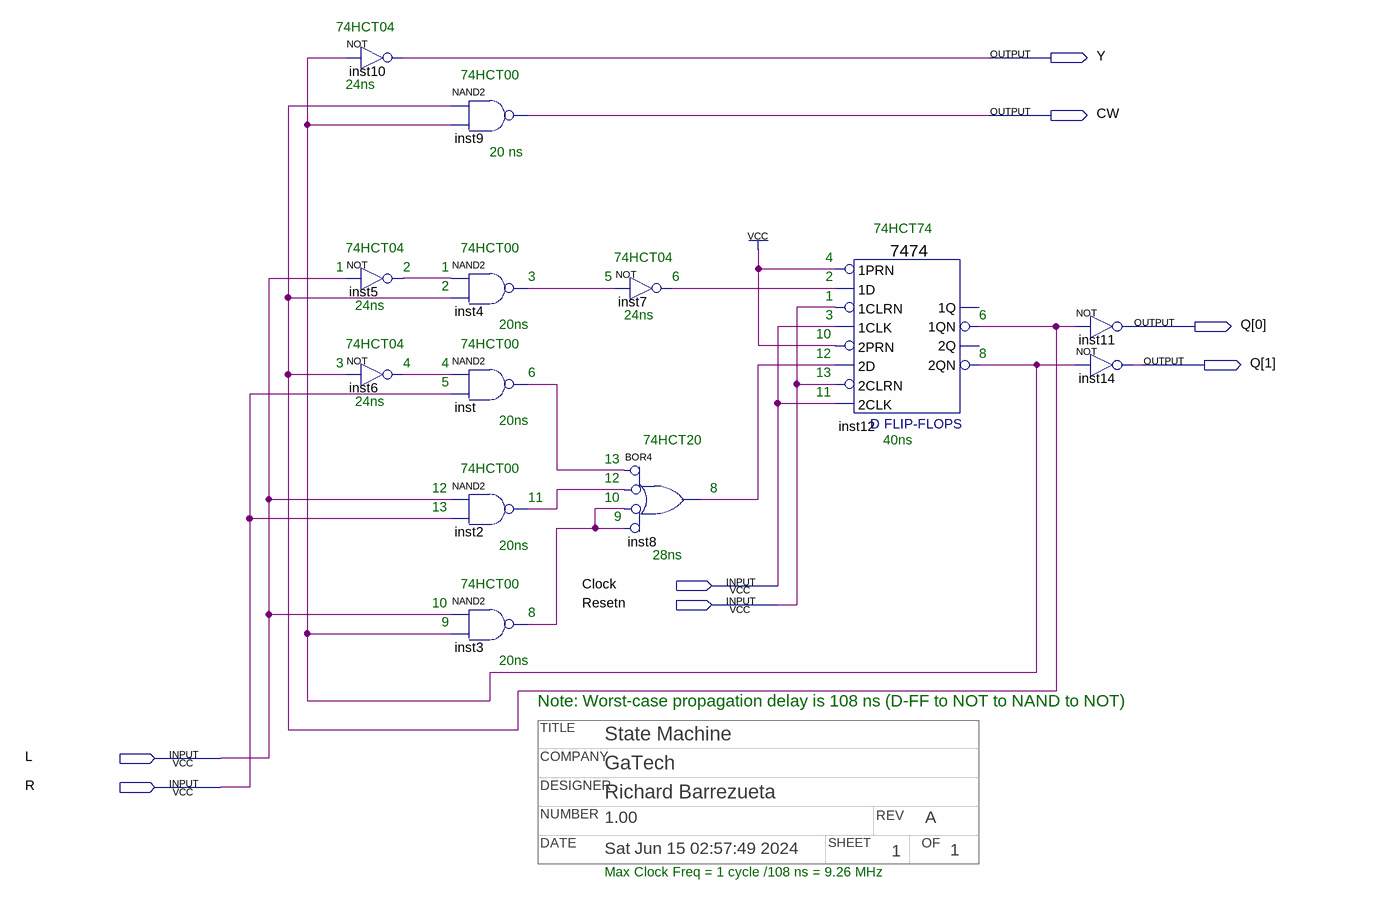
[diagram p0: schematic sheet]
// Quartus schematic StateMachine.bdf as structural Verilog: 13 symbols, 8 pins
// Title block: COMPANY: GaTech; DATE: Sat Jun 15 02:57:49 2024; DESIGNER: Richard Barrezueta; NUMBER: 1.00; OF: 1; REV: A; SHEET: 1; TITLE: State Machine
module StateMachine (
  input  Clock,
  input  Resetn,
  input  L,
  input  R,
  output Y,
  output CW,
  output [1:0] Q
);

  wire inst2_out, inst3_out, inst4_out, inst5_out, inst6_out, inst7_out, inst8_out, inst12_1qn, inst12_2qn,
       inst_out;

  not inst10 (Y, inst12_2qn);
  not inst5 (inst5_out, L);
  not inst6 (inst6_out, inst12_1qn);
  nand inst9 (CW, inst12_1qn, inst12_2qn);
  nand inst4 (inst4_out, inst5_out, inst12_1qn);
  nand inst (inst_out, inst6_out, R);
  nand inst2 (inst2_out, L, R);
  nand inst3 (inst3_out, L, inst12_2qn);
  not inst7 (inst7_out, inst4_out);
  or inst8 (inst8_out, ~inst_out, ~inst2_out, ~inst3_out, ~inst3_out);  // BOR4
  \7474  inst12 (
    .\2D (inst8_out), .\2PRN (1'b1), .\1CLK (Clock), .\1D (inst7_out), .\1PRN (1'b1), .\2CLK (Clock),
    .\2CLRN (Resetn), .\1CLRN (Resetn), .\1QN (inst12_1qn), .\2QN (inst12_2qn));  // open: 2Q, 1Q
  not inst11 (Q[0], inst12_1qn);
  not inst14 (Q[1], inst12_2qn);

  // Notes on the sheet:
  //   74HCT04
  //   74HCT00
  //   24ns
  //   20 ns
  //   74HCT74
  //   74HCT04
  //   74HCT00
  //   74HCT04
  //   4
  //   1
  //   2
  //   1
  //   3
  //   5
  //   6
  //   2
  //   2
  //   1
  //   24ns
  //   24ns
  //   3
  //   6
  //   20ns
  //   10
  //   74HCT04
  //   74HCT00
  //   12
  //   8
  //   3
  //   4
  //   4
  //   6
  //   13
  //   5
  //   11
  //   24ns
  //   20ns
  //   74HCT20
  //   40ns
  //   13
  //   74HCT00
  //   12
  //   12
  //   8
  //   11
  //   10
  //   13
  //   9
  //   20ns
  //   28ns
  //   74HCT00
  //   10
  //   8
  //   9
  //   20ns
  //   Note: Worst-case propagation delay is 108 ns (D-FF to NOT to NAND to NOT)
  //   Max Clock Freq = 1 cycle /108 ns = 9.26 MHz
endmodule
